# EAGLE schematic Oldest Schematic (EAGLE 9.2.2)
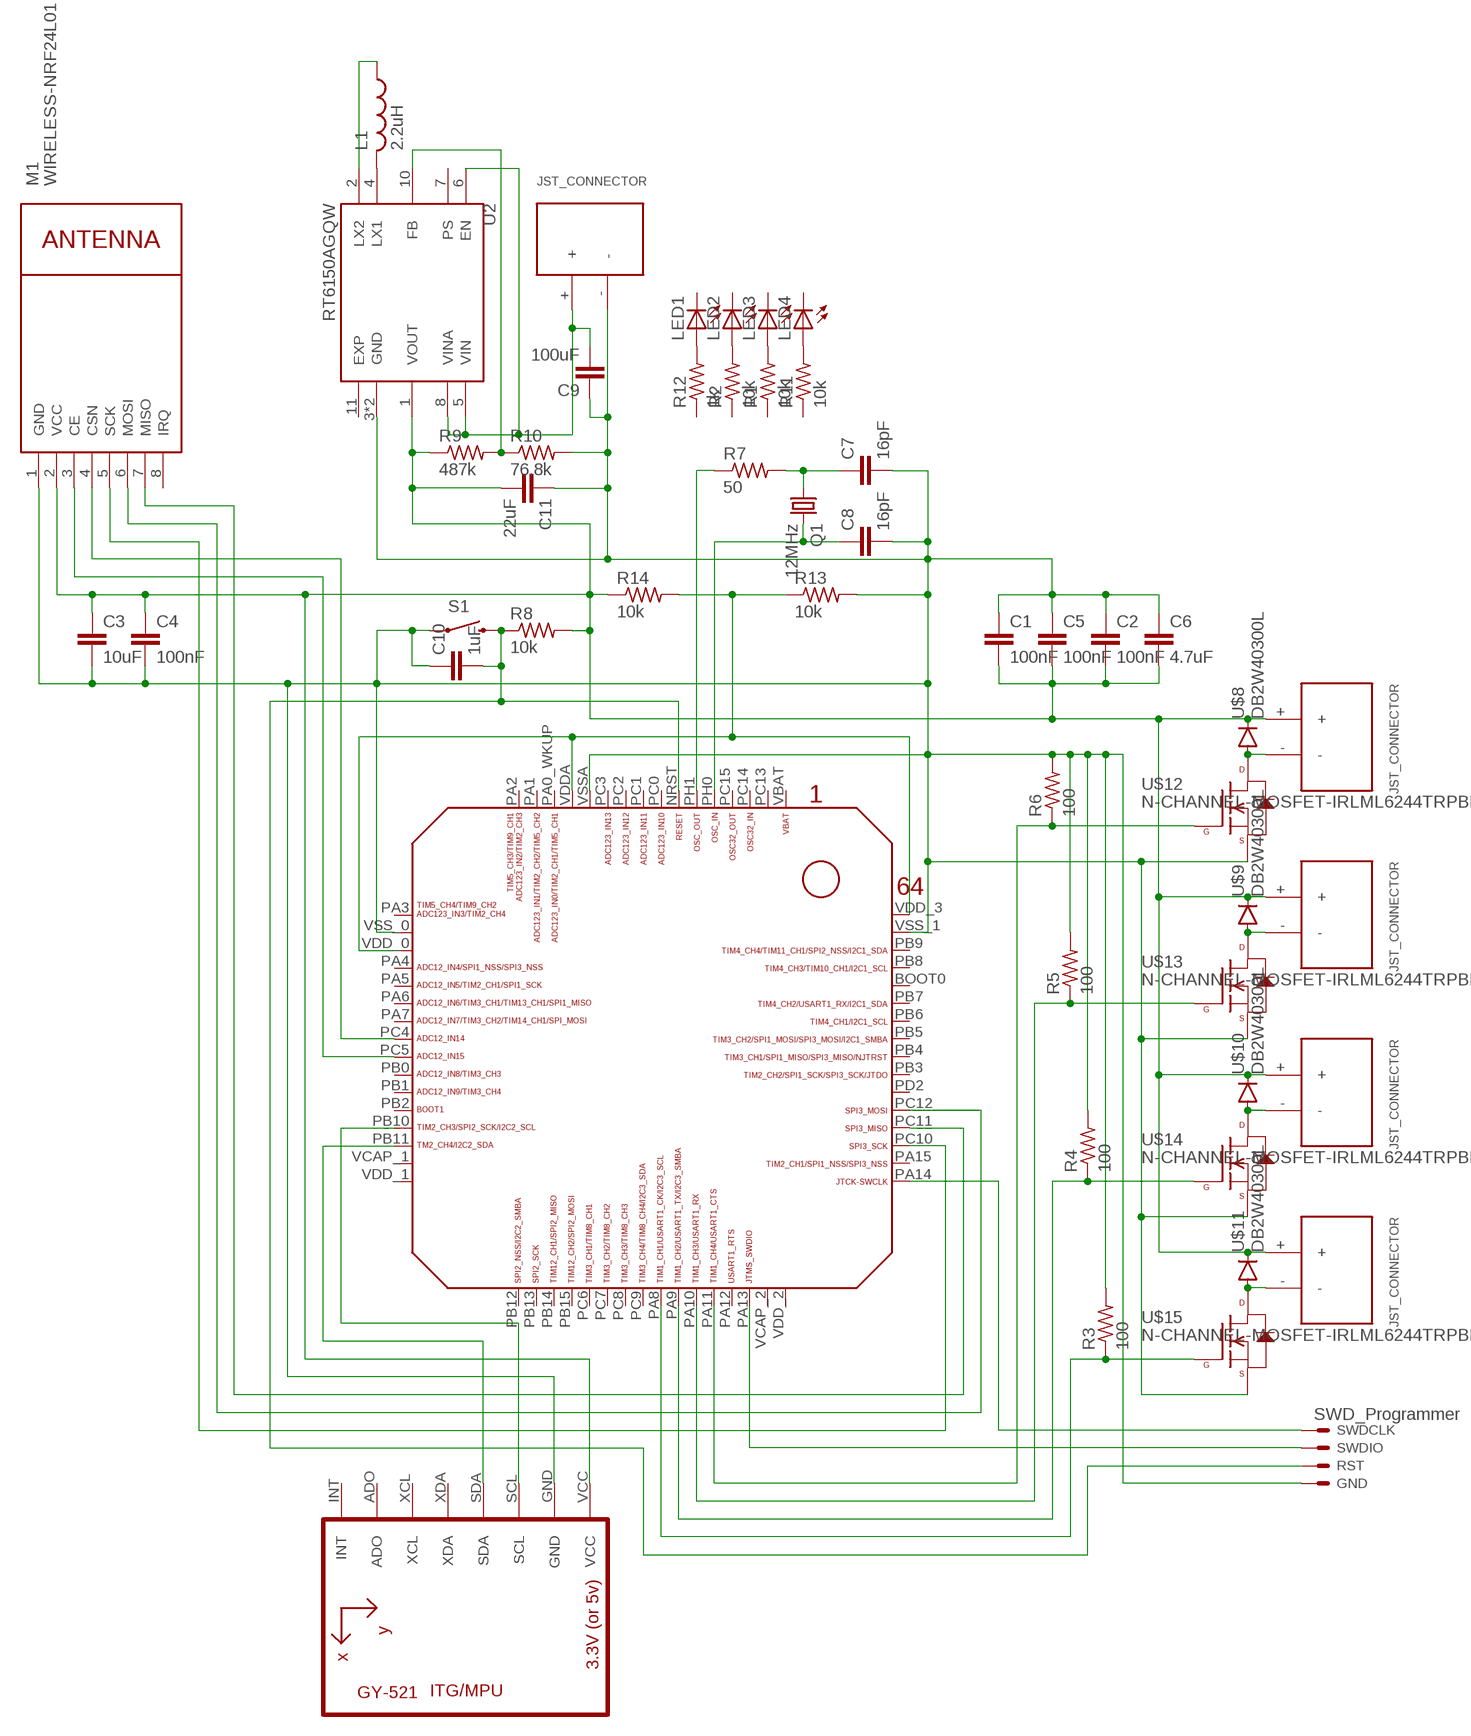
[diagram p0: schematic, sheet 1]

## Parts
C1  100nF  C-EUC0603  [C0603]
C2  100nF  C-EUC0603  [C0603]
C3  10uF  C-EUC0603  [C0603]
C4  100nF  C-EUC0603  [C0603]
C5  100nF  C-EUC0603  [C0603]
C6  4.7uF  C-EUC0603  [C0603]
C7  16pF  C-EUC0603  [C0603]
C8  16pF  C-EUC0603  [C0603]
C9  100uF  C-EUC1206  [C1206]
C10  1uF  C-EUC0603  [C0603]
C11  22uF  C-EUC0603  [C0603]
L1  2.2uH  L-USL0603  [L0603]
LED1  LEDSML0603  [SML0603]
LED2  LEDSML0603  [SML0603]
LED3  LEDSML0603  [SML0603]
LED4  LEDSML0603  [SML0603]
M1  WIRELESS-NRF24L01  [WIRELESS-NRF24L01]
PIN  SWD_Programmer  53261-04  [53261-04]
Q1  12MHz  CRYSTALHC49UP  [HC49UP]
R1  10k  R-US_R0603  [R0603]
R2  10k  R-US_R0603  [R0603]
R3  100  R-US_R0603  [R0603]
R4  100  R-US_R0603  [R0603]
R5  100  R-US_R0603  [R0603]
R6  100  R-US_R0603  [R0603]
R7  50  R-US_R0603  [R0603]
R8  10k  R-US_R0603  [R0603]
R9  487k  R-US_R0603  [R0603]
R10  76.8k  R-US_R0603  [R0603]
R11  10k  R-US_R0603  [R0603]
R12  1k  R-US_R0603  [R0603]
R13  10k  R-US_R0603  [R0603]
R14  10k  R-US_R0603  [R0603]
S1  SWITCH-MOMENTARY-2SMD  [TACTILE-SWITCH-SMD]
U1  GY-521MPU6050  [GY-521]
U2  RT6150AGQW  [SON50P250X250X80-11N]
U$1  STM32F405/415_LQFP64  [STM32F405/415_LQFP64]
U$2  JST_CONNECTOR_FEMALE  [JST_CONNECTOR_FEMALE]
U$4  JST_CONNECTOR_FEMALE  [JST_CONNECTOR_FEMALE]
U$5  JST_CONNECTOR_FEMALE  [JST_CONNECTOR_FEMALE]
U$6  JST_CONNECTOR_FEMALE  [JST_CONNECTOR_FEMALE]
U$7  JST_CONNECTOR_FEMALE  [JST_CONNECTOR_FEMALE]
U$8  DB2W40300L  [MINI2-F3-B]
U$9  DB2W40300L  [MINI2-F3-B]
U$10  DB2W40300L  [MINI2-F3-B]
U$11  DB2W40300L  [MINI2-F3-B]
U$12  N-CHANNEL-MOSFET-IRLML6244TRPBF  [SOT23-3]
U$13  N-CHANNEL-MOSFET-IRLML6244TRPBF  [SOT23-3]
U$14  N-CHANNEL-MOSFET-IRLML6244TRPBF  [SOT23-3]
U$15  N-CHANNEL-MOSFET-IRLML6244TRPBF  [SOT23-3]

## Nets
N$1: C9.2 U2.5(VIN) U2.6(EN) U2.8(VINA) U$2.+
N$2: U$7.- U$11.POS(PPIN) U$15.3(D)
N$3: LED1.A R12.2
N$4: M1.3(CE) U$1.PC5
N$5: M1.5(SCK) U$1.PC10
N$6: M1.4(CSN) U$1.PC4
N$7: M1.6(MOSI) U$1.PC12
N$8: M1.7(MISO) U$1.PC11
N$9: U$6.- U$10.POS(PPIN) U$14.3(D)
N$10: U$5.- U$9.POS(PPIN) U$13.3(D)
N$11: U$4.- U$8.POS(PPIN) U$12.3(D)
N$12: C1.2 C2.2 C3.1 C4.1 C5.2 C6.2 C11.2 M1.2(VCC) R8.2 R9.1 R14.1 U1.VCC U2.1(VOUT) U$4.+ U$5.+ U$6.+ U$7.+ U$8.NEG(GPIN) U$9.NEG(GPIN) U$10.NEG(GPIN) U$11.NEG(GPIN)
N$13: R6.1 U$1.PA11 U$12.1(G)
N$14: R5.1 U$1.PA10 U$13.1(G)
N$15: R4.1 U$1.PA9 U$14.1(G)
N$16: R3.1 U$1.PA8 U$15.1(G)
N$17: C7.1 Q1.1 R7.2
N$18: R7.1 U$1.PH1
N$19: C8.1 Q1.2 U$1.PH0
N$20: PIN.1 U$1.PA14
N$21: PIN.2 U$1.PA13
N$22: C10.2 PIN.3 R8.1 S1.3 U$1.NRST
N$23: LED2.A R2.2
N$24: U1.SDA U$1.PB11
N$25: U1.SCL U$1.PB10
N$26: L1.2 U2.4(LX1)
N$27: R9.2 R10.1 U2.10(FB)
N$28: L1.1 U2.2(LX2)
N$29: C1.1 C2.1 C3.2 C4.2 C5.1 C6.1 C7.2 C8.2 C9.1 C10.1 C11.1 M1.1(GND) PIN.4 R3.2 R4.2 R5.2 R6.2 R10.2 R13.2 S1.1 U1.GND U2.3(GND) U2.9(GND) U$1.VSS_0 U$1.VSS_1 U$1.VSSA U$2.- U$12.2(S) U$13.2(S) U$14.2(S) U$15.2(S)
N$30: R13.1 R14.2 U$1.VDD_0 U$1.VDD_3 U$1.VDDA
N$31: LED3.A R1.2
N$32: LED4.A R11.2
Unconnected: LED1.C LED2.C LED3.C LED4.C M1.8(IRQ) R1.1 R2.1 R11.1 R12.1 U1.ADO U1.INT U1.XCL U1.XDA U2.7(PS) U2.11(EXP) U$1.BOOT0 U$1.PA0_WKUP(PA0_AKUP) U$1.PA1 U$1.PA2 U$1.PA3 U$1.PA4 U$1.PA5 U$1.PA6 U$1.PA7 U$1.PA12 U$1.PA15 U$1.PB0 U$1.PB1 U$1.PB2 U$1.PB3 U$1.PB4 U$1.PB5 U$1.PB6 U$1.PB7 U$1.PB8 U$1.PB9 U$1.PB12 U$1.PB13 U$1.PB14 U$1.PB15 U$1.PC0 U$1.PC1 U$1.PC2 U$1.PC3 U$1.PC6 U$1.PC7 U$1.PC8 U$1.PC9 U$1.PC13 U$1.PC14 U$1.PC15 U$1.PD2 U$1.VBAT U$1.VCAP_1 U$1.VCAP_2 U$1.VDD_1 U$1.VDD_2

## Notes on the sheet
- SWDCLK
- SWDIO
- RST
- GND

## Library data of the parts
C1-C11 = rcl:C-EU: CAPACITOR, European symbol; SPICEPREFIX: C
L1 = rcl-2:L-US: INDUCTOR, American symbol
LED1-LED4 = led:LED: LED OSRAM: - CHIPLED LG R971, LG N971, LY N971, LG Q971, LY Q971, LO R971, LY R971 LH N974, LH R974 LS Q976, LO Q976, LY Q976 LO Q996 - Hyper CHIPLED LW Q18S LB Q993, LB Q99A, LB R99A - SideLED LS A670, LO A670, LY A670, LG A670, LP A670 LB A673, LV A673, LT A673, LW A673 LH A674 LY A675 LS A676, LA A676, LO A676, LY A676, LW A676 LS A679, LY A679, LG A679 - Hyper Micro SIDELED® LS Y876, LA Y876, LO Y876, LY Y876 LT Y87S - SmartLED LW L88C, LW L88S LB L89C, LB L89S, LG L890 LS L89K, LO L89K, LY L89K LS L896, LA L896, LO L896, LY L896 - TOPLED LS T670, LO T670, LY T670, LG T670, LP T670 LSG T670, LSP T670, LSY T670, LOP T670, LYG T670 LG T671, LOG T671, LSG T671 LB T673, LV T673, LT T673, LW T673 LH T674 LS T676, LA T676, LO T676, LY T676, LB T676, LH T676, LSB T676, LW T676 LB T67C, LV T67C, LT T67C, LS T67K, LO T67K, LY T67K, LW E67C LS E67B, LA E67B, LO E67B, LY E67B, LB E67C, LV E67C, LT E67C LW T67C LS T679, LY T679, LG T679 LS T770, LO T770, LY T770, LG T770, LP T770 LB T773, LV T773, LT T773, LW T773 LH T774 LS E675, LA E675, LY E675, LS T675 LS T776, LA T776, LO T776, LY T776, LB T776 LHGB T686 LT T68C, LB T68C - Hyper Mini TOPLED® LB M676 - Mini TOPLED Santana® LG M470 LS M47K, LO M47K, LY M47K Source: http://www.osram.convergy.de LUXEON: - LUMILED® LXK2-PW12-R00, LXK2-PW12-S00, LXK2-PW14-U00, LXK2-PW14-V00 LXK2-PM12-R00, LXK2-PM12-S00, LXK2-PM14-U00 LXK2-PE12-Q00, LXK2-PE12-R00, LXK2-PE12-S00, LXK2-PE14-T00, LXK2-PE14-U00 LXK2-PB12-K00, LXK2-PB12-L00, LXK2-PB12-M00, LXK2-PB14-N00, LXK2-PB14-P00, LXK2-PB14-Q00 LXK2-PR12-L00, LXK2-PR12-M00, LXK2-PR14-Q00, LXK2-PR14-R00 LXK2-PD12-Q00, LXK2-PD12-R00, LXK2-PD12-S00 LXK2-PH12-R00, LXK2-PH12-S00 LXK2-PL12-P00, LXK2-PL12-Q00, LXK2-PL12-R00 Source: www.luxeon.com KINGBRIGHT: KA-3528ASYC Source: www.kingbright.com
M1 = AP_quad:WIRELESS-NRF24L01: 2.4 GHz Wireless Module based on NRF24L01 chip
PIN = con-molex:53?-04: CONNECTOR wire to board 1.25 mm (.049 inch) pitch header; MF: MOLEX; OC_FARNELL: 1125374; OC_NEWARK: unknown
Q1 = crystal:CRYSTAL: CRYSTAL; OC_FARNELL: unknown; OC_NEWARK: unknown
R1-R14 = rcl:R-US_: RESISTOR, American symbol; SPICEPREFIX: R
S1 = AP_quad:SWITCH-MOMENTARY-2: Various NO switches- pushbuttons, reed, etc; PROD_ID: SWCH-08247
U1 = AP_quad:GY-521
U2 = RT6150AGQW:RT6150AGQW: Dc/Dc Conv, Buck-Boost, 1mhz, Wdfn-10; AVAILABILITY: Unavailable; DESCRIPTION: Dc-Dc Conv, Buck/Boost, 1mhz, Wdfn-10; MF: Richtek USA; MP: RT6150AGQW; PACKAGE: WFDFN-10 Richtek; PRICE: None
U$1 = AP_quad:STM32F405/415_LQFP64
U$2 U$4-U$7 = AP_quad:JST_CONNECTOR_FEMALE
U$8-U$11 = AP_quad:DB2W40300L
U$12-U$15 = AP_quad:N-CHANNEL-MOSFET: N-Channel MOSFET Mode Field Effect Transistor; DATASHEET: http://www.mouser.com/ds/2/196/irlml6244pbf-936666.pdf; MOUSER: 942-IRLML6244TRPBF; URL: http://www.mouser.com/Search/ProductDetail.aspx?R=IRLML6244TRPBFvirtualkey57370000virtualkey942-IRLML6244TRPBF